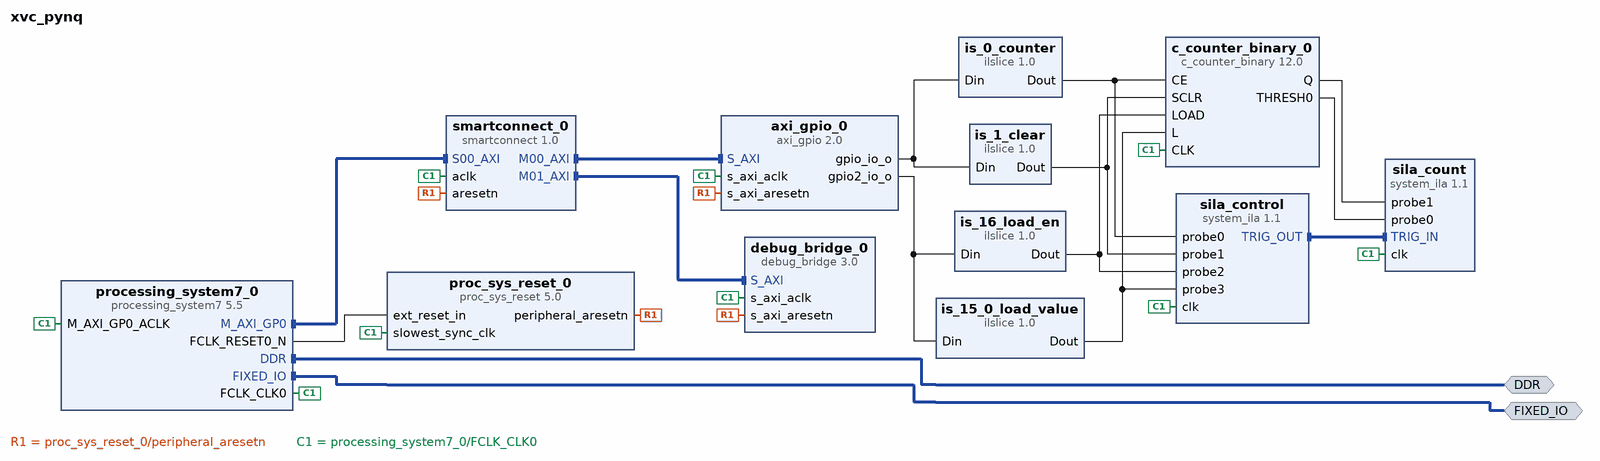
[diagram p0: block diagram of the top level]
# Vivado block design xvc_pynq, xc7z020clg484-1, Vivado 2026.1
create_bd_design xvc_pynq

create_bd_intf_port -mode Master -vlnv xilinx.com:interface:ddrx_rtl:1.0 DDR
create_bd_intf_port -mode Master -vlnv xilinx.com:display_processing_system7:fixedio_rtl:1.0 FIXED_IO

create_bd_cell -type ip -vlnv xilinx.com:ip:processing_system7:5.5 processing_system7_0
set_property -dict [list \
  CONFIG.PCW_APU_PERIPHERAL_FREQMHZ 650 \
  CONFIG.PCW_CRYSTAL_PERIPHERAL_FREQMHZ 50.000000 \
  CONFIG.PCW_ENET0_ENET0_IO {MIO 16 .. 27} \
  CONFIG.PCW_ENET0_GRP_MDIO_ENABLE 1 \
  CONFIG.PCW_ENET0_GRP_MDIO_IO EMIO \
  CONFIG.PCW_ENET0_PERIPHERAL_ENABLE 1 \
  CONFIG.PCW_ENET0_RESET_ENABLE 0 \
  CONFIG.PCW_ENET_RESET_ENABLE 1 \
  CONFIG.PCW_ENET_RESET_SELECT {Share reset pin} \
  CONFIG.PCW_FPGA0_PERIPHERAL_FREQMHZ 100 \
  CONFIG.PCW_FPGA1_PERIPHERAL_FREQMHZ 50 \
  CONFIG.PCW_GPIO_MIO_GPIO_ENABLE 1 \
  CONFIG.PCW_GPIO_MIO_GPIO_IO MIO \
  CONFIG.PCW_I2C_RESET_ENABLE 1 \
  CONFIG.PCW_PERIPHERAL_BOARD_PRESET part0 \
  CONFIG.PCW_PRESET_BANK1_VOLTAGE {LVCMOS 1.8V} \
  CONFIG.PCW_QSPI_GRP_FBCLK_ENABLE 1 \
  CONFIG.PCW_QSPI_GRP_FBCLK_IO {MIO 8} \
  CONFIG.PCW_QSPI_GRP_SINGLE_SS_ENABLE 1 \
  CONFIG.PCW_QSPI_GRP_SINGLE_SS_IO {MIO 1 .. 6} \
  CONFIG.PCW_QSPI_PERIPHERAL_ENABLE 1 \
  CONFIG.PCW_QSPI_QSPI_IO {MIO 1 .. 6} \
  CONFIG.PCW_SD0_GRP_CD_ENABLE 1 \
  CONFIG.PCW_SD0_GRP_CD_IO {MIO 47} \
  CONFIG.PCW_SD0_GRP_WP_ENABLE 1 \
  CONFIG.PCW_SD0_GRP_WP_IO EMIO \
  CONFIG.PCW_SD0_PERIPHERAL_ENABLE 1 \
  CONFIG.PCW_SD0_SD0_IO {MIO 40 .. 45} \
  CONFIG.PCW_SDIO_PERIPHERAL_FREQMHZ 50 \
  CONFIG.PCW_SINGLE_QSPI_DATA_MODE x4 \
  CONFIG.PCW_TTC0_PERIPHERAL_ENABLE 1 \
  CONFIG.PCW_TTC0_TTC0_IO EMIO \
  CONFIG.PCW_UART1_PERIPHERAL_ENABLE 1 \
  CONFIG.PCW_UART1_UART1_IO {MIO 48 .. 49} \
  CONFIG.PCW_UART_PERIPHERAL_FREQMHZ 100 \
  CONFIG.PCW_UIPARAM_DDR_FREQ_MHZ 525 \
  CONFIG.PCW_UIPARAM_DDR_PARTNO {MT41K128M16 JT-125} \
  CONFIG.PCW_USB0_PERIPHERAL_ENABLE 1 \
  CONFIG.PCW_USB0_RESET_ENABLE 1 \
  CONFIG.PCW_USB0_RESET_IO {MIO 46} \
  CONFIG.PCW_USB0_USB0_IO {MIO 28 .. 39} \
  CONFIG.PCW_USB_RESET_ENABLE 1 \
  CONFIG.PCW_USB_RESET_SELECT {Share reset pin} \
  CONFIG.preset None \
] [get_bd_cells processing_system7_0]
# 500 more settings of processing_system7_0 are not shown: defaults, MIO pin electricals, DDR timing, and values the tool derives
create_bd_cell -type ip -vlnv xilinx.com:ip:proc_sys_reset:5.0 proc_sys_reset_0
create_bd_cell -type ip -vlnv xilinx.com:ip:smartconnect:1.0 smartconnect_0
set_property -dict {CONFIG.NUM_MI 2 CONFIG.NUM_SI 1} [get_bd_cells smartconnect_0]
create_bd_cell -type ip -vlnv xilinx.com:ip:axi_gpio:2.0 axi_gpio_0
set_property -dict [list \
  CONFIG.C_ALL_INPUTS 0 \
  CONFIG.C_ALL_OUTPUTS 1 \
  CONFIG.C_ALL_OUTPUTS_2 1 \
  CONFIG.C_GPIO2_WIDTH 17 \
  CONFIG.C_GPIO_WIDTH 2 \
  CONFIG.C_IS_DUAL 1 \
  CONFIG.GPIO_BOARD_INTERFACE Custom \
  CONFIG.USE_BOARD_FLOW true \
] [get_bd_cells axi_gpio_0]
create_bd_cell -type ip -vlnv xilinx.com:ip:debug_bridge:3.0 debug_bridge_0
set_property -dict {CONFIG.C_DEBUG_MODE 2} [get_bd_cells debug_bridge_0]
create_bd_cell -type inline_hdl -vlnv xilinx.com:inline_hdl:ilslice:1.0 is_0_counter
set_property -dict {CONFIG.DIN_WIDTH 2} [get_bd_cells is_0_counter]
create_bd_cell -type inline_hdl -vlnv xilinx.com:inline_hdl:ilslice:1.0 is_1_clear
set_property -dict {CONFIG.DIN_FROM 1 CONFIG.DIN_TO 1 CONFIG.DIN_WIDTH 2} [get_bd_cells is_1_clear]
create_bd_cell -type inline_hdl -vlnv xilinx.com:inline_hdl:ilslice:1.0 is_16_load_en
set_property -dict {CONFIG.DIN_FROM 16 CONFIG.DIN_TO 16 CONFIG.DIN_WIDTH 17} [get_bd_cells is_16_load_en]
create_bd_cell -type inline_hdl -vlnv xilinx.com:inline_hdl:ilslice:1.0 is_15_0_load_value
set_property -dict {CONFIG.DIN_FROM 15 CONFIG.DIN_WIDTH 17} [get_bd_cells is_15_0_load_value]
create_bd_cell -type ip -vlnv xilinx.com:ip:c_counter_binary:12.0 c_counter_binary_0
set_property -dict [list \
  CONFIG.CE true \
  CONFIG.Load true \
  CONFIG.Restrict_Count false \
  CONFIG.SCLR true \
  CONFIG.Sync_Threshold_Output true \
] [get_bd_cells c_counter_binary_0]
create_bd_cell -type ip -vlnv xilinx.com:ip:system_ila:1.1 sila_count
set_property -dict [list \
  CONFIG.C_ADV_TRIGGER true \
  CONFIG.C_DATA_DEPTH 131072 \
  CONFIG.C_EN_STRG_QUAL 1 \
  CONFIG.C_INPUT_PIPE_STAGES 2 \
  CONFIG.C_MON_TYPE NATIVE \
  CONFIG.C_NUM_OF_PROBES 2 \
  CONFIG.C_PROBE1_WIDTH 16 \
  CONFIG.C_PROBE_WIDTH_PROPAGATION MANUAL \
  CONFIG.C_TRIGIN_EN true \
] [get_bd_cells sila_count]
create_bd_cell -type ip -vlnv xilinx.com:ip:system_ila:1.1 sila_control
set_property -dict [list \
  CONFIG.ALL_PROBE_SAME_MU true \
  CONFIG.C_ADV_TRIGGER true \
  CONFIG.C_EN_STRG_QUAL 1 \
  CONFIG.C_INPUT_PIPE_STAGES 2 \
  CONFIG.C_MON_TYPE NATIVE \
  CONFIG.C_NUM_OF_PROBES 4 \
  CONFIG.C_PROBE3_WIDTH 16 \
  CONFIG.C_PROBE_WIDTH_PROPAGATION MANUAL \
  CONFIG.C_TRIGOUT_EN true \
] [get_bd_cells sila_control]

# ---- connections ----

connect_bd_intf_net [get_bd_intf_ports DDR] [get_bd_intf_pins processing_system7_0/DDR]
connect_bd_intf_net [get_bd_intf_ports FIXED_IO] [get_bd_intf_pins processing_system7_0/FIXED_IO]
connect_bd_intf_net [get_bd_intf_pins processing_system7_0/M_AXI_GP0] [get_bd_intf_pins smartconnect_0/S00_AXI]
connect_bd_intf_net -intf_net sila_count_TRIG_OUT [get_bd_intf_pins sila_control/TRIG_OUT] [get_bd_intf_pins sila_count/TRIG_IN]
connect_bd_intf_net [get_bd_intf_pins axi_gpio_0/S_AXI] [get_bd_intf_pins smartconnect_0/M00_AXI]
connect_bd_intf_net [get_bd_intf_pins debug_bridge_0/S_AXI] [get_bd_intf_pins smartconnect_0/M01_AXI]
connect_bd_net [get_bd_pins axi_gpio_0/gpio2_io_o] [get_bd_pins is_16_load_en/Din] [get_bd_pins is_15_0_load_value/Din]
connect_bd_net [get_bd_pins axi_gpio_0/gpio_io_o] [get_bd_pins is_0_counter/Din] [get_bd_pins is_1_clear/Din]
connect_bd_net [get_bd_pins c_counter_binary_0/Q] [get_bd_pins sila_count/probe1]
connect_bd_net [get_bd_pins c_counter_binary_0/THRESH0] [get_bd_pins sila_count/probe0]
connect_bd_net [get_bd_pins is_0_counter/Dout] [get_bd_pins c_counter_binary_0/CE] [get_bd_pins sila_control/probe0]
connect_bd_net [get_bd_pins is_15_0_load_value/Dout] [get_bd_pins c_counter_binary_0/L] [get_bd_pins sila_control/probe3]
connect_bd_net [get_bd_pins is_16_load_en/Dout] [get_bd_pins c_counter_binary_0/LOAD] [get_bd_pins sila_control/probe2]
connect_bd_net [get_bd_pins is_1_clear/Dout] [get_bd_pins c_counter_binary_0/SCLR] [get_bd_pins sila_control/probe1]
connect_bd_net [get_bd_pins proc_sys_reset_0/peripheral_aresetn] \
  [get_bd_pins axi_gpio_0/s_axi_aresetn] [get_bd_pins smartconnect_0/aresetn] [get_bd_pins debug_bridge_0/s_axi_aresetn]
connect_bd_net [get_bd_pins processing_system7_0/FCLK_CLK0] \
  [get_bd_pins proc_sys_reset_0/slowest_sync_clk] [get_bd_pins axi_gpio_0/s_axi_aclk] [get_bd_pins smartconnect_0/aclk] \
  [get_bd_pins processing_system7_0/M_AXI_GP0_ACLK] [get_bd_pins debug_bridge_0/s_axi_aclk] \
  [get_bd_pins c_counter_binary_0/CLK] [get_bd_pins sila_count/clk] [get_bd_pins sila_control/clk]
connect_bd_net [get_bd_pins processing_system7_0/FCLK_RESET0_N] [get_bd_pins proc_sys_reset_0/ext_reset_in]

# ---- address map ----
assign_bd_address -offset 0x41200000 -range 4K -target_address_space [get_bd_addr_spaces processing_system7_0/Data] [get_bd_addr_segs axi_gpio_0/S_AXI/Reg]
assign_bd_address -offset 0x43C00000 -range 64K -target_address_space [get_bd_addr_spaces processing_system7_0/Data] [get_bd_addr_segs debug_bridge_0/S_AXI/Reg0]

validate_bd_design
save_bd_design
